# EAGLE schematic midicontrol_v5 (EAGLE 9.4.0)
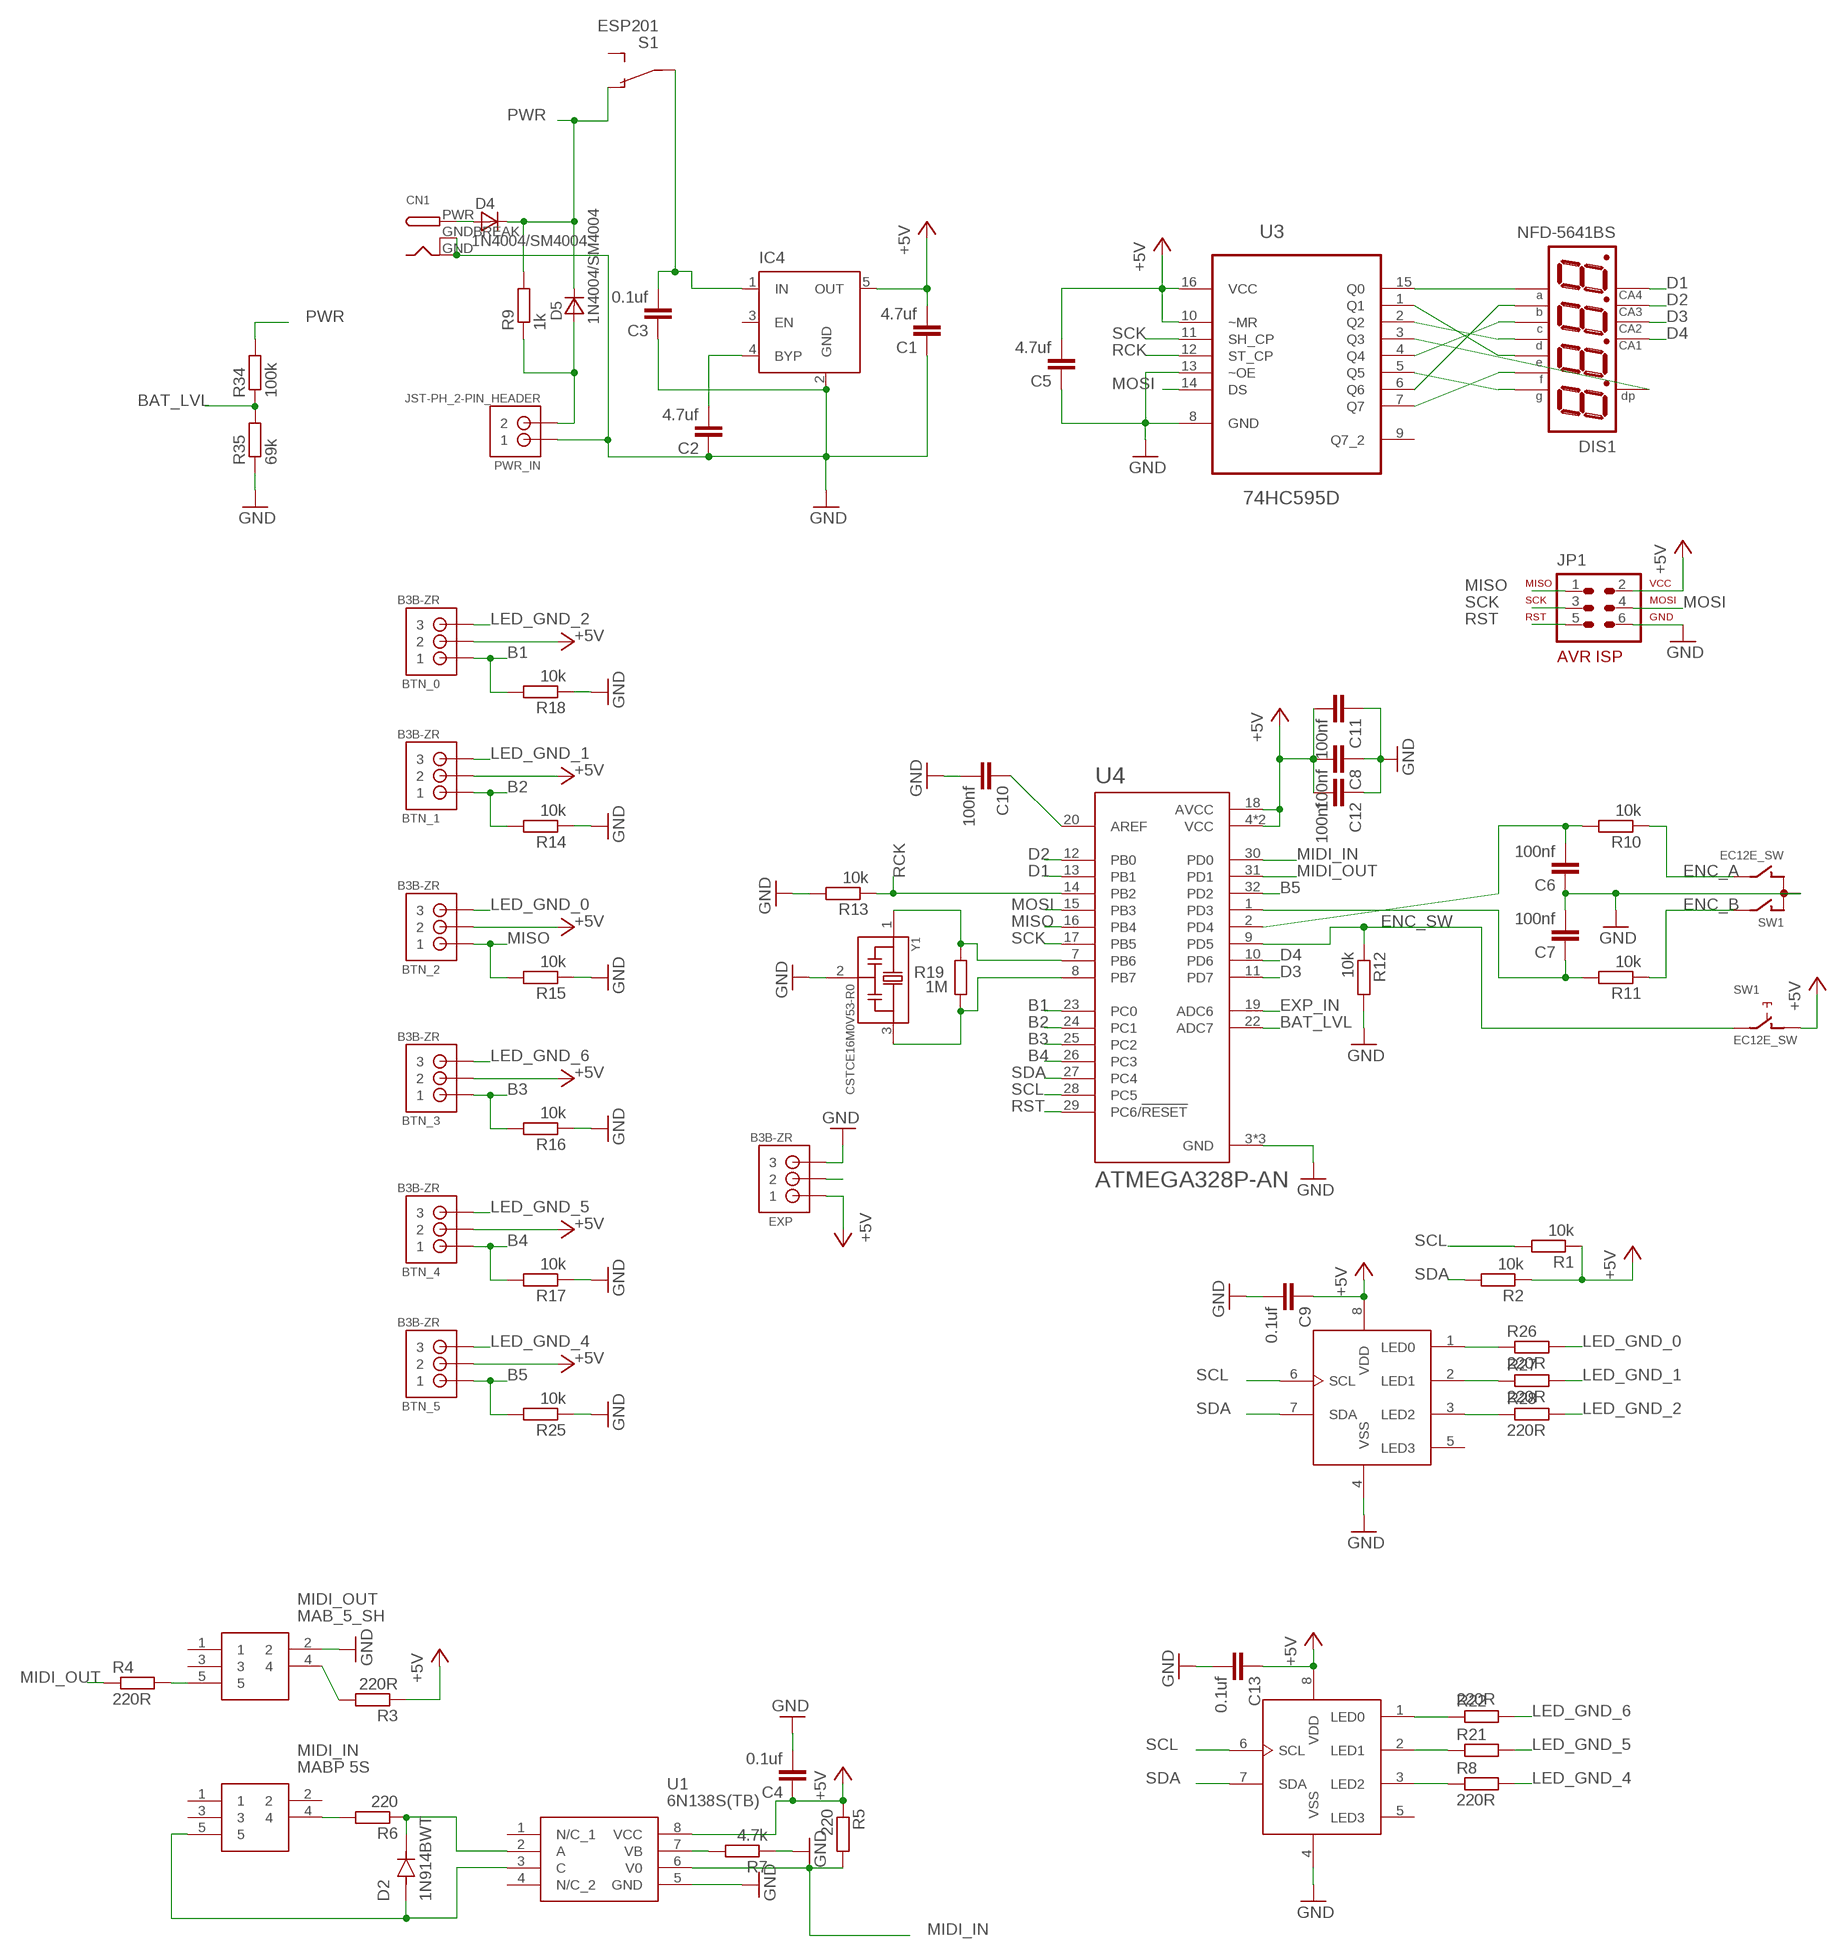
[diagram p0: schematic, sheet 1]

## Parts
BTN_0  B3B-ZR  [B3B-ZR]
BTN_1  B3B-ZR  [B3B-ZR]
BTN_2  B3B-ZR  [B3B-ZR]
BTN_3  B3B-ZR  [B3B-ZR]
BTN_4  B3B-ZR  [B3B-ZR]
BTN_5  B3B-ZR  [B3B-ZR]
C1  4.7uf  C-EUC1206  [C1206]
C2  4.7uf  C-EUC1206  [C1206]
C3  0.1uf  C-EUC1206  [C1206]
C4  0.1uf  C-EUC0603  [C0603]
C5  4.7uf  C-EUC0603  [C0603]
C6  100nf  C-EUC0603  [C0603]
C7  100nf  C-EUC0603  [C0603]
C8  100nf  C-EUC1206  [C1206]
C9  0.1uf  C-EUC0603  [C0603]
C10  100nf  C-EUC0603  [C0603]
C11  100nf  C-EUC0603  [C0603]
C12  100nf  C-EUC0603  [C0603]
C13  0.1uf  C-EUC0603  [C0603]
CN1  DCBARRELPTH  [DCJACK_2MM_PTH]
D2  1N914BWT  [SODFL1608X70N]
D4  1N4004/SM4004  SM4004  [MELF-MLL41]
D5  1N4004/SM4004  SM4004  [MELF-MLL41]
DIS1  NFD-5641BS  [NFD-5641]
EXP  B3B-ZR  [B3B-ZR]
IC4  MIC5219XX  [SOT23-5]
JP1  AVR-ISP-6HORZ  [AVR-ISP-6R]
MIDI_IN  MABP 5S  MAB_5_SH  [MAB-5-SH]
MIDI_OUT  MAB_5_SH  [MAB-5-SH]
PCA1  PCA9533  [SOIC8]
PCA9533  PCA9533  [SOIC8]
PWR_IN  JST-PH_2-PIN_HEADER  [JST_B2B-PH_HEADER]
R1  10k  R-EU_R0603  [R0603]
R2  10k  R-EU_R0603  [R0603]
R3  220R  R-EU_R0603  [R0603]
R4  220R  R-EU_R0603  [R0603]
R5  220  R-EU_R0603  [R0603]
R6  220  R-EU_R0603  [R0603]
R7  4.7k  R-EU_R0603  [R0603]
R8  220R  R-EU_R0603  [R0603]
R9  1k  R-EU_R0603  [R0603]
R10  10k  R-EU_R0603  [R0603]
R11  10k  R-EU_R0603  [R0603]
R12  10k  R-EU_R0603  [R0603]
R13  10k  R-EU_R0603  [R0603]
R14  10k  R-EU_R0603  [R0603]
R15  10k  R-EU_R0603  [R0603]
R16  10k  R-EU_R0603  [R0603]
R17  10k  R-EU_R0603  [R0603]
R18  10k  R-EU_R0603  [R0603]
R19  1M  R-EU_R0603  [R0603-ROUND]
R21  220R  R-EU_R0603  [R0603]
R22  220R  R-EU_R0603  [R0603]
R25  10k  R-EU_R0603  [R0603]
R26  220R  R-EU_R0603  [R0603]
R27  220R  R-EU_R0603  [R0603]
R28  220R  R-EU_R0603  [R0603]
R34  100k  R-EU_R0603  [R0603]
R35  69k  R-EU_R0603  [R0603]
S1  ESP201  [ESP201]
SW1  EC12E_SW  [ALPS_EC12E_SW]
U1  6N138S(TB)  [SOP254P1030X460-8N]
U3  74HC595D  [SOIC127P600X175-16N]
U4  ATMEGA328P-AN  [QFP80P900X900X120-32N]
Y1  CSTCE16M0V53-R0  [OSC_CSTCE16M0V53-R0]

## Nets
+5V: BTN_0.2 BTN_1.2 BTN_2.2 BTN_3.2 BTN_4.2 BTN_5.2 C1.2 C4.1 C5.2 C8.2 C9.1 C11.2 C12.2 C13.1 EXP.1 IC4.5(OUT) JP1.2 PCA1.8(VDD) PCA9533.8(VDD) R1.1 R2.1 R3.1 R5.1 SW1.D U1.8(VCC) U3.10(~MR) U3.16(VCC) U4.4(VCC) U4.6(VCC) U4.18(AVCC)
B1: BTN_0.1 R18.2 U4.23(PC0)
B2: BTN_1.1 R14.2 U4.24(PC1)
B3: BTN_3.1 R16.2 U4.25(PC2)
B4: BTN_4.1 R17.2 U4.26(PC3)
B5: BTN_5.1 R25.2 U4.32(PD2)
BAT_LVL: R34.1 R35.2 U4.22(ADC7)
D1: DIS1.P$6 U4.13(PB1)
D2: DIS1.P$8 U4.12(PB0)
D3: DIS1.P$9 U4.11(PD7)
D4: DIS1.P$12 U4.10(PD6)
ENC_A: R10.1 SW1.B
ENC_B: R11.1 SW1.A
ENC_SW: R12.1 SW1.E U4.9(PD5)
EXP_IN: EXP.2 U4.19(ADC6)
GND: C1.1 C2.1 C3.1 C4.2 C5.1 C6.1 C7.2 C8.1 C9.2 C10.2 C11.1 C12.1 C13.2 CN1.GND CN1.GNDBREAK EXP.3 IC4.2(GND) JP1.6 MIDI_OUT.2 PCA1.4(VSS) PCA9533.4(VSS) PWR_IN.P1 R7.1 R12.2 R13.2 R14.1 R15.1 R16.1 R17.1 R18.1 R25.1 R35.1 SW1.C U1.5(GND) U3.8(GND) U3.13(~OE) U4.3(GND) U4.5(GND) U4.21(GND) Y1.2
LED_GND_0: BTN_2.3 R26.2
LED_GND_1: BTN_1.3 R27.2
LED_GND_2: BTN_0.3 R28.2
LED_GND_4: BTN_5.3 R8.2
LED_GND_5: BTN_4.3 R21.2
LED_GND_6: BTN_3.3 R22.2
MIDI_IN: R5.2 U1.6(V0) U4.30(PD0)
MIDI_OUT: R4.1 U4.31(PD1)
MISO: BTN_2.1 JP1.1 R15.2 U4.16(PB4)
MOSI: JP1.4 U3.14(DS) U4.15(PB3)
N$1: DIS1.P$11 U3.15(Q0)
N$2: DIS1.P$7 U3.6(Q6)
N$3: DIS1.P$4 U3.4(Q4)
N$4: DIS1.P$2 U3.2(Q2)
N$5: DIS1.P$1 U3.1(Q1)
N$6: DIS1.P$10 U3.7(Q7)
N$7: DIS1.P$5 U3.5(Q5)
N$8: DIS1.P$3 U3.3(Q3)
N$9: MIDI_OUT.4 R3.2
N$10: MIDI_OUT.5 R4.2
N$11: D2.A MIDI_IN.5 U1.3(C)
N$12: D2.C(K) R6.1 U1.2(A)
N$13: MIDI_IN.4 R6.2
N$14: R7.2 U1.7(VB)
N$15: C6.2 R10.2 U4.2(PD4)
N$16: R19.1 U4.8(PB7) Y1.3
N$17: C7.1 R11.2 U4.1(PD3)
N$18: D5.A PWR_IN.P2 R9.1
N$19: R19.2 U4.7(PB6) Y1.1
N$20: C2.2 IC4.4(BYP)
N$21: C10.1 U4.20(AREF)
N$22: PCA9533.3(LED2) R28.1
N$23: PCA9533.2(LED1) R27.1
N$24: PCA9533.1(LED0) R26.1
N$25: CN1.PWR D4.A
N$26: C3.2 IC4.1(IN) S1.P$1(P)
N$27: PCA1.2(LED1) R21.1
N$28: PCA1.3(LED2) R8.1
N$29: PCA1.1(LED0) R22.1
PWR: D4.C D5.C R9.2 R34.2 S1.P$3(O)
RCK: R13.1 U3.12(ST_CP) U4.14(PB2)
RST: JP1.5 U4.29(PC6/!RESET)
SCK: JP1.3 U3.11(SH_CP) U4.17(PB5)
SCL: PCA1.6(SCL) PCA9533.6(SCL) R1.2 U4.28(PC5)
SDA: PCA1.7(SDA) PCA9533.7(SDA) R2.2 U4.27(PC4)
Unconnected: IC4.3(EN) MIDI_IN.1 MIDI_IN.2 MIDI_IN.3 MIDI_OUT.1 MIDI_OUT.3 PCA1.5(LED3) PCA9533.5(LED3) S1.P$2(S) SW1.GND1(G) SW1.GND2(G) U1.1(N/C_1) U1.4(N/C_2) U3.9(Q7_2)

## Library data of the parts
BTN_0 BTN_1-BTN_5 EXP = jst:B3B-ZR: JST-ZH Connector 3 pol, 1.5mm pitch Package: B3B-ZR Source: http://www.jst-mfg.com/product/pdf/eng/eZH.pdf
C1-C13 = rcl:C-EU: CAPACITOR, European symbol; SPICEPREFIX: C
CN1 = adafruit:DCBARREL: 2.0mm DC Barrel Jack DCJACK_2MM_PTH - Through Hole Jack (4UConnector: 05537)
D2 = 1N914BWT:1N914BWT: 1N914B Series 75 V 300 mA Surface Mount Small Signal Diode - SOD-523F; AVAILABILITY: Unavailable; DESCRIPTION: 1N914B Series 75 V 300 mA Surface Mount Small Signal Diode - SOD-523F; MF: ON Semiconductor; MP: 1N914BWT; PACKAGE: SOD-523F ON Semiconductor; PRICE: None
D4 D5 = _mod_diode:SM400*: SM4001 .. SM4007 General Purpose Rectifier, 1 A SMD-Version of 1N4001 .. 1N4007 Case: MELF-MLL41 = DO 213 AB Author: Dipl.-Ing. FH Rainer Bayer HHN Hochschule Heilbronn, rainer.bayer@hs-heilbronn.de Ingenieurbüro ing-rb, mail@ing-rb.de
DIS1 = display-misc:NFD-5641BS: Four Digit 0.56" CA Seven-Segment LED Display Futurlec part number: 7FR5641BS Created by RobG
IC4 = v-reg-micrel:MIC5219XX: VOLTAGE REGULATOR; OC_FARNELL: unknown; OC_NEWARK: unknown
JP1 = avr-7:AVR-ISP-6: AVR ISP-6 Serial Programming Header
MIDI_IN MIDI_OUT = MAB_5_SH:MAB_5_SH: HIRSCHMANN - MAB 5 SH - SOCKET, DIN, PCB, 5PIN Source: Datasheet <http://www.farnell.com/datasheets/1599432.pdf>; DESCRIPTION: HIRSCHMANN - MAB 5 SH - SOCKET, DIN, PCB, 5PIN; HEIGHT: mm; MANUFACTURER_NAME: Hirschmann; MANUFACTURER_PART_NUMBER: MAB 5 SH
PCA1 PCA9533 = adam - ics:PCA9533: PCA9533D/01: LED driver and dimmer 4 channel, PWM @ 8 bit resolution 25mA / channel sink external resistors per LED I2C protocol @ 400kHz (fast) digikey: 568-3372-5-ND, 8-SOIC, $1.92
PWR_IN = srg:JST-PH_2-PIN_HEADER: 2-pin JST PH Shrouded Header, top entry P/N B2B-PH-K-S Mating connector PHR-2 Mating cable assembly: Sparkfun PRT-09914 <http://www.sparkfun.com/products/9914>
R1-R18 R21 R22 R25-R28 R34 R35 = rcl:R-EU_: RESISTOR, European symbol; SPICEPREFIX: R
R19 = SmartPrj:R-EU_: RESISTOR, European symbol
S1 = olli:ESP201: Switch ESP201 available at reichelt.de
SW1 = switch-alps:EC12E_SW: ALPS rotary Encoder EC12E series with switch; MPN: EC12E2424407; OC_FARNELL: 1520813; OC_NEWARK: 74M1068
U1 = 6N138S(TB):6N138S(TB): High Speed Optocouplers Low Input, High Gain DC Input Source: Datasheet <https://componentsearchengine.com/Datasheets/1/6N138S(TB).pdf>; DESCRIPTION: High Speed Optocouplers Low Input, High Gain DC Input; HEIGHT: 4.6mm; MANUFACTURER_NAME: Everlight; MANUFACTURER_PART_NUMBER: 6N138S(TB); MOUSER_PART_NUMBER: 638-6N138STB; MOUSER_PRICE-STOCK: https://www.mouser.com/Search/Refine.aspx?Keyword=638-6N138STB
U3 = 74HC595D:74HC595D: 8-bit serial-in parallel-out shift register; AVAILABILITY: Unavailable; DESCRIPTION: Shift Register Single 8-Bit Serial to Serial/Parallel 16-Pin SO; MF: Toshiba Semiconductor; MP: 74HC595D; PACKAGE: SO-16 NXP Semiconductors; PRICE: None
U4 = ATMEGA328P-AN:ATMEGA328P-AN: ATmega Series 20 MHz 32 KB Flash 2 KB SRAM 8-Bit Microcontroller - TQFP-32; AVAILABILITY: Unavailable; DESCRIPTION: MCU 8-bit ATmega AVR RISC 32KB Flash 2.5V/3.3V/5V 32-Pin TQFP Tray; MF: Microchip; MP: ATMEGA328P-AN; PACKAGE: TQFP-32 Microchip; PRICE: None
Y1 = CSTCE16M0V53-R0:CSTCE16M0V53-R0: 16MHz Ceramic Resonator Built in Capacitor 15pF ±0.3% -20°C ~ 80°C Surface Mount; AVAILABILITY: Unavailable; DESCRIPTION: Ceramic Resonator 16MHz ??0.5% _Tol_ ??0.3% _Stability_ 15pF 40Ohm 3-Pin CSMD T/R; MF: Murata; MP: CSTCE16M0V53-R0; PACKAGE: SMD-3 Murata; PRICE: None

## Net classes
0 default: clearance 0.152 mm